# Altium schematic sheet MIPI_DSI_CSI.SchDoc
size 420 x 297 mm; Scale: 1:1; DocumentType: Схема электрическая принципиальная; SheetNumber: 20; SheetTotal: 31; DocumentTypeShort: Э3; DocumentInvertoryNumber: ㅤ
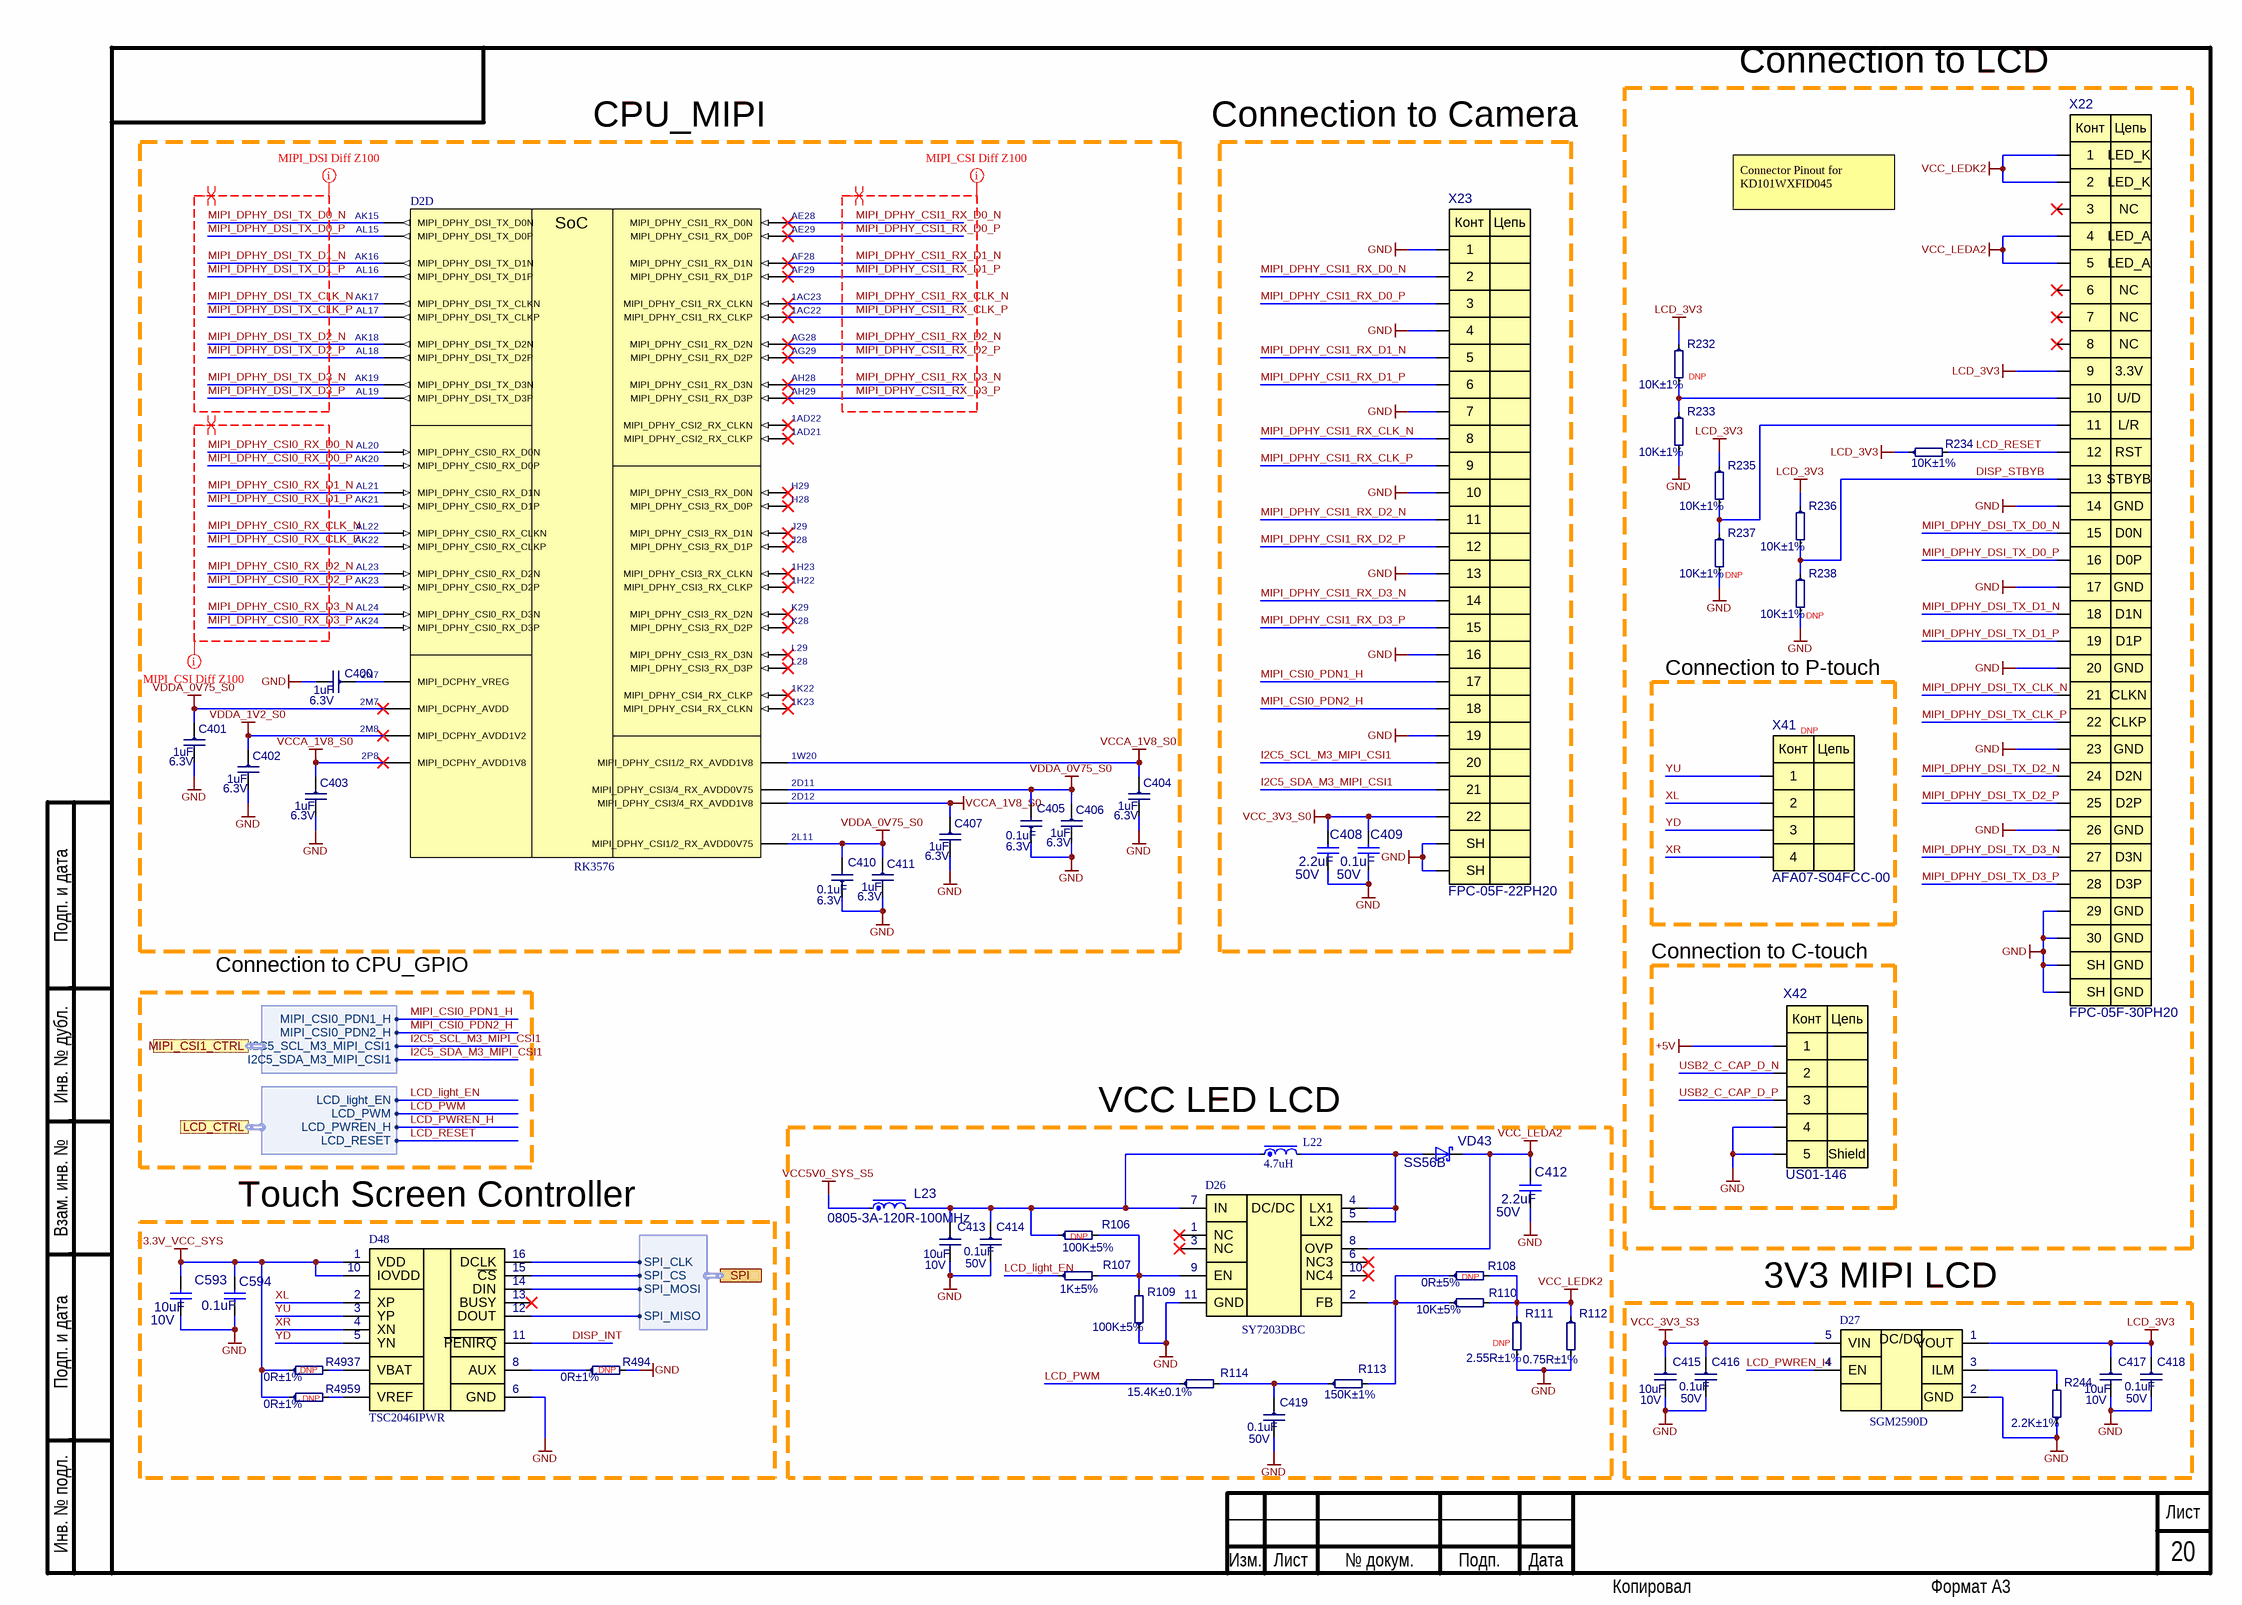
[diagram p0: MIPI_DSI_CSI.SchDoc]

## Parts
C400  1uF  Voltage: 6.3V  [C0201]
C401  1uF  Voltage: 6.3V  [C0201]
C402  1uF  Voltage: 6.3V  [C0201]
C403  1uF  Voltage: 6.3V  [C0201]
C404  1uF  Voltage: 6.3V  [C0201]
C405  0.1uF  Voltage: 6.3V  [C0201]
C406  1uF  Voltage: 6.3V  [C0201]
C407  1uF  Voltage: 6.3V  [C0201]
C408  2.2uF  Voltage: 50V  [C0805]
C409  0.1uF  Voltage: 50V  [C0402]
C410  0.1uF  Voltage: 6.3V  [C0201]
C411  1uF  Voltage: 6.3V  [C0201]
C412  2.2uF  Voltage: 50V  [C0805]
C413  10uF  Voltage: 10V  [C0603]
C414  0.1uF  Voltage: 50V  [C0402]
C415  10uF  Voltage: 10V  [C0603]
C416  0.1uF  Voltage: 50V  [C0402]
C417  10uF  Voltage: 10V  [C0603]
C418  0.1uF  Voltage: 50V  [C0402]
C419  0.1uF  Voltage: 50V  [C0402]
C593  10uF  Voltage: 10V  [C0402]
C594  0.1uF  [C0402]
D2  RK3576  [BGAFCCSP698L]  (part D of 7)
D26  SY7203DBC  [SY7203DBC]
D27  SGM2590D  [SGM2590D]
D48  TSC2046IPWR  [TSC2046IPWR]
L22  4.7uH  [SWPA6045S4R7MT]
L23  0805-3A-120R-100MHz  [L0805]
R106  100K±5%  [R0402]
R107  1K±5%  [R0402]
R108  0R±5%  [R1206]
R109  100K±5%  [R0402]
R110  10K±5%  [R1206]
R111  2.55R±1%  [R1206]
R112  0.75R±1%  [R1206]
R113  150K±1%  [R0402]
R114  15.4K±0.1%  [R0603]
R232  10K±1%  [R0402]
R233  10K±1%  [R0402]
R234  10K±1%  [R0402]
R235  10K±1%  [R0402]
R236  10K±1%  [R0402]
R237  10K±1%  [R0402]
R238  10K±1%  [R0402]
R244  2.2K±1%  [R0402]
R493  0R±1%  [R0402]
R494  0R±1%  [R0402]
R495  0R±1%  [R0402]
VD43  SS56B  [DO-214AA]
X22  FPC-05F-30PH20  [FPC-05F-30PH20]
X23  FPC-05F-22PH20  [FPC-05F-22PH20]
X41  AFA07-S04FCC-00  [AFA07-S04FCC-00]
X42  US01-146  [US01-146]

## Blocks framed on the sheet
Connection to P-touch: X41
Connection to C-touch: X42

## Ports
LCD_CTRL (harness LCD_CTRL), MIPI_CSI1_CTRL (harness MIPI_CSI1), SPI (harness SPI)

## Harnesses
MIPI_CSI1: I2C5_SDA_M3_MIPI_CSI1, I2C5_SCL_M3_MIPI_CSI1, MIPI_CSI0_PDN2_H, MIPI_CSI0_PDN1_H
LCD_CTRL: LCD_RESET, LCD_PWREN_H, LCD_PWM, LCD_light_EN
SPI: SPI_CS, SPI_MISO, SPI_MOSI, SPI_CLK

## Nets
+3.3V_VCC_SYS: C593.2 C594.2 D48.1(VDD) D48.10(IOVDD) R493.1 R495.1
+5V: X42.1
GND: C400.2 C401.2 C402.2 C403.2 C404.2 C405.1 C406.2 C407.2 C408.1 C409.1 C410.1 C411.2 C412.1 C413.2 C414.2 C415.2 C416.2 C417.2 C418.2 C419.2 C593.1 C594.1 D26.11(GND) D27.2(GND) D48.6(GND) R109.1 R111.2 R112.2 R233.2 R237.2 R238.2 R244.1 R494.2 X22.14 X22.17 X22.20 X22.23 X22.26 X22.29 X22.30 X22.S1(SH) X22.S2(SH) X23.1 X23.4 X23.7 X23.10 X23.13 X23.16 X23.19 X23.23(SH) X23.24(SH) X42.4 X42.5
LCD_3V3: C417.1 C418.1 D27.1(VOUT) R232.1 R234.1 R235.1 R236.1 X22.9
VCC5V0_SYS_S5: L23.1
VCC_3V3_S0: C408.2 C409.2 X23.22
VCC_3V3_S3: C415.1 C416.1 D27.5(VIN)
VCC_LEDA2: C412.2 D26.8(OVP) VD43.1(K) X22.4 X22.5
VCC_LEDK2: R108.2 R110.2 R111.1 R112.1 X22.1 X22.2
VCCA_1V8_S0: C403.1 C404.1 C407.1 D2.1W20(MIPI_DPHY_CSI1/2_RX_AVDD1V8) D2.2D12(MIPI_DPHY_CSI3/4_RX_AVDD1V8) D2.2P8(MIPI_DCPHY_AVDD1V8)
VDDA_0V75_S0: C401.1 C405.2 C406.1 C410.2 C411.1 D2.2D11(MIPI_DPHY_CSI3/4_RX_AVDD0V75) D2.2L11(MIPI_DPHY_CSI1/2_RX_AVDD0V75) D2.2M7(MIPI_DCPHY_AVDD)
VDDA_1V2_S0: C402.1 D2.2M8(MIPI_DCPHY_AVDD1V2)
DISP_INT: D48.11(~{PENIRQ})
DISP_STBYB: R236.2 R238.1 X22.13
I2C5_SCL_M3_MIPI_CSI1: X23.20 ; port MIPI_CSI1_CTRL.I2C5_SCL_M3_MIPI_CSI1
I2C5_SDA_M3_MIPI_CSI1: X23.21 ; port MIPI_CSI1_CTRL.I2C5_SDA_M3_MIPI_CSI1
LCD_light_EN: R107.1 ; port LCD_CTRL.LCD_light_EN
LCD_PWM: R114.1 ; port LCD_CTRL.LCD_PWM
LCD_PWREN_H: D27.4(EN) ; port LCD_CTRL.LCD_PWREN_H
LCD_RESET: R234.2 X22.12 ; port LCD_CTRL.LCD_RESET
MIPI_CSI0_PDN1_H: X23.17 ; port MIPI_CSI1_CTRL.MIPI_CSI0_PDN1_H
MIPI_CSI0_PDN2_H: X23.18 ; port MIPI_CSI1_CTRL.MIPI_CSI0_PDN2_H
MIPI_DPHY_CSI0_RX_CLK_N: D2.AL22(MIPI_DPHY_CSI0_RX_CLKN)
MIPI_DPHY_CSI0_RX_CLK_P: D2.AK22(MIPI_DPHY_CSI0_RX_CLKP)
MIPI_DPHY_CSI0_RX_D0_N: D2.AL20(MIPI_DPHY_CSI0_RX_D0N)
MIPI_DPHY_CSI0_RX_D0_P: D2.AK20(MIPI_DPHY_CSI0_RX_D0P)
MIPI_DPHY_CSI0_RX_D1_N: D2.AL21(MIPI_DPHY_CSI0_RX_D1N)
MIPI_DPHY_CSI0_RX_D1_P: D2.AK21(MIPI_DPHY_CSI0_RX_D1P)
MIPI_DPHY_CSI0_RX_D2_N: D2.AL23(MIPI_DPHY_CSI0_RX_D2N)
MIPI_DPHY_CSI0_RX_D2_P: D2.AK23(MIPI_DPHY_CSI0_RX_D2P)
MIPI_DPHY_CSI0_RX_D3_N: D2.AL24(MIPI_DPHY_CSI0_RX_D3N)
MIPI_DPHY_CSI0_RX_D3_P: D2.AK24(MIPI_DPHY_CSI0_RX_D3P)
MIPI_DPHY_CSI1_RX_CLK_N: D2.1AC23(MIPI_DPHY_CSI1_RX_CLKN) X23.8
MIPI_DPHY_CSI1_RX_CLK_P: D2.1AC22(MIPI_DPHY_CSI1_RX_CLKP) X23.9
MIPI_DPHY_CSI1_RX_D0_N: D2.AE28(MIPI_DPHY_CSI1_RX_D0N) X23.2
MIPI_DPHY_CSI1_RX_D0_P: D2.AE29(MIPI_DPHY_CSI1_RX_D0P) X23.3
MIPI_DPHY_CSI1_RX_D1_N: D2.AF28(MIPI_DPHY_CSI1_RX_D1N) X23.5
MIPI_DPHY_CSI1_RX_D1_P: D2.AF29(MIPI_DPHY_CSI1_RX_D1P) X23.6
MIPI_DPHY_CSI1_RX_D2_N: D2.AG28(MIPI_DPHY_CSI1_RX_D2N) X23.11
MIPI_DPHY_CSI1_RX_D2_P: D2.AG29(MIPI_DPHY_CSI1_RX_D2P) X23.12
MIPI_DPHY_CSI1_RX_D3_N: D2.AH28(MIPI_DPHY_CSI1_RX_D3N) X23.14
MIPI_DPHY_CSI1_RX_D3_P: D2.AH29(MIPI_DPHY_CSI1_RX_D3P) X23.15
MIPI_DPHY_DSI_TX_CLK_N: D2.AK17(MIPI_DPHY_DSI_TX_CLKN) X22.21
MIPI_DPHY_DSI_TX_CLK_P: D2.AL17(MIPI_DPHY_DSI_TX_CLKP) X22.22
MIPI_DPHY_DSI_TX_D0_N: D2.AK15(MIPI_DPHY_DSI_TX_D0N) X22.15
MIPI_DPHY_DSI_TX_D0_P: D2.AL15(MIPI_DPHY_DSI_TX_D0P) X22.16
MIPI_DPHY_DSI_TX_D1_N: D2.AK16(MIPI_DPHY_DSI_TX_D1N) X22.18
MIPI_DPHY_DSI_TX_D1_P: D2.AL16(MIPI_DPHY_DSI_TX_D1P) X22.19
MIPI_DPHY_DSI_TX_D2_N: D2.AK18(MIPI_DPHY_DSI_TX_D2N) X22.24
MIPI_DPHY_DSI_TX_D2_P: D2.AL18(MIPI_DPHY_DSI_TX_D2P) X22.25
MIPI_DPHY_DSI_TX_D3_N: D2.AK19(MIPI_DPHY_DSI_TX_D3N) X22.27
MIPI_DPHY_DSI_TX_D3_P: D2.AL19(MIPI_DPHY_DSI_TX_D3P) X22.28
USB2_C_CAP_D_N: X42.2
USB2_C_CAP_D_P: X42.3
XL: D48.2(XP) X41.2
XR: D48.4(XN) X41.4
YD: D48.5(YN) X41.3
YU: D48.3(YP) X41.1
NetC400_1: C400.1 D2.2N7(MIPI_DCPHY_VREG)
NetC413_1: C413.1 C414.1 D26.7(IN) L22.1 L23.2 R106.1
NetC419_1: C419.1 R113.1 R114.2
NetD26_2: D26.2(FB) R108.1 R110.1 R113.2
NetD26_4: D26.4(LX1) D26.5(LX2) L22.2 VD43.2(A)
NetD26_9: D26.9(EN) R106.2 R107.2 R109.2
NetD27_3: D27.3(ILM) R244.2
NetD48_7: D48.7(VBAT) R493.2
NetD48_8: D48.8(AUX) R494.1
NetD48_9: D48.9(VREF) R495.2
NetD48_12: D48.12(DOUT) ; port SPI.SPI_MISO
NetD48_14: D48.14(DIN) ; port SPI.SPI_MOSI
NetD48_15: D48.15(~{CS}) ; port SPI.SPI_CS
NetD48_16: D48.16(DCLK) ; port SPI.SPI_CLK
NetR232_2: R232.2 R233.1 X22.10
NetR235_2: R235.2 R237.1 X22.11

Not connected (* = marked no-connect by the designer): D2 1AD21(MIPI_DPHY_CSI2_RX_CLKP)* 1AD22(MIPI_DPHY_CSI2_RX_CLKN)* 1H22(MIPI_DPHY_CSI3_RX_CLKP)* 1H23(MIPI_DPHY_CSI3_RX_CLKN)* 1K22(MIPI_DPHY_CSI4_RX_CLKP)* 1K23(MIPI_DPHY_CSI4_RX_CLKN)* H28(MIPI_DPHY_CSI3_RX_D0P)* H29(MIPI_DPHY_CSI3_RX_D0N)* J28(MIPI_DPHY_CSI3_RX_D1P)* J29(MIPI_DPHY_CSI3_RX_D1N)* K28(MIPI_DPHY_CSI3_RX_D2P)* K29(MIPI_DPHY_CSI3_RX_D2N)* L28(MIPI_DPHY_CSI3_RX_D3P)* L29(MIPI_DPHY_CSI3_RX_D3N)*; D26 1(NC)* 3(NC)* 6(NC3)* 10(NC4)*; D48 13(BUSY)*; X22 3* 6* 7* 8*

## Layout directives
differential pair: MIPI_DPHY_CSI0_RX_CLK_N, MIPI_DPHY_CSI0_RX_CLK_P, MIPI_DPHY_CSI0_RX_D0_N, MIPI_DPHY_CSI0_RX_D0_P, MIPI_DPHY_CSI0_RX_D1_N, MIPI_DPHY_CSI0_RX_D1_P, MIPI_DPHY_CSI0_RX_D2_N, MIPI_DPHY_CSI0_RX_D2_P, MIPI_DPHY_CSI0_RX_D3_N, MIPI_DPHY_CSI0_RX_D3_P, MIPI_DPHY_CSI1_RX_CLK_N, MIPI_DPHY_CSI1_RX_CLK_P, MIPI_DPHY_CSI1_RX_D0_N, MIPI_DPHY_CSI1_RX_D0_P, MIPI_DPHY_CSI1_RX_D1_N, MIPI_DPHY_CSI1_RX_D1_P, MIPI_DPHY_CSI1_RX_D2_N, MIPI_DPHY_CSI1_RX_D2_P, MIPI_DPHY_CSI1_RX_D3_N, MIPI_DPHY_CSI1_RX_D3_P, MIPI_DPHY_DSI_TX_CLK_N, MIPI_DPHY_DSI_TX_CLK_P, MIPI_DPHY_DSI_TX_D0_N, MIPI_DPHY_DSI_TX_D0_P, MIPI_DPHY_DSI_TX_D1_N, MIPI_DPHY_DSI_TX_D1_P, MIPI_DPHY_DSI_TX_D2_N, MIPI_DPHY_DSI_TX_D2_P, MIPI_DPHY_DSI_TX_D3_N, MIPI_DPHY_DSI_TX_D3_P
net class MIPI_CSI1: MIPI_DPHY_CSI1_RX_CLK_N, MIPI_DPHY_CSI1_RX_CLK_P, MIPI_DPHY_CSI1_RX_D0_N, MIPI_DPHY_CSI1_RX_D0_P, MIPI_DPHY_CSI1_RX_D1_N, MIPI_DPHY_CSI1_RX_D1_P, MIPI_DPHY_CSI1_RX_D2_N, MIPI_DPHY_CSI1_RX_D2_P, MIPI_DPHY_CSI1_RX_D3_N, MIPI_DPHY_CSI1_RX_D3_P
net class MIPI_DSI: MIPI_DPHY_DSI_TX_CLK_N, MIPI_DPHY_DSI_TX_CLK_P, MIPI_DPHY_DSI_TX_D0_N, MIPI_DPHY_DSI_TX_D0_P, MIPI_DPHY_DSI_TX_D1_N, MIPI_DPHY_DSI_TX_D1_P, MIPI_DPHY_DSI_TX_D2_N, MIPI_DPHY_DSI_TX_D2_P, MIPI_DPHY_DSI_TX_D3_N, MIPI_DPHY_DSI_TX_D3_P
net class MIPI_CSI0: MIPI_DPHY_CSI0_RX_CLK_N, MIPI_DPHY_CSI0_RX_CLK_P, MIPI_DPHY_CSI0_RX_D0_N, MIPI_DPHY_CSI0_RX_D0_P, MIPI_DPHY_CSI0_RX_D1_N, MIPI_DPHY_CSI0_RX_D1_P, MIPI_DPHY_CSI0_RX_D2_N, MIPI_DPHY_CSI0_RX_D2_P, MIPI_DPHY_CSI0_RX_D3_N, MIPI_DPHY_CSI0_RX_D3_P

## Notes on the sheet
- Connection to LCD
- CPU_MIPI
- Connection to Camera
- Connector Pinout for KD101WXFID045
- (near X22) LED_K
- (near X22) NC
- (near X22) LED_A
- (near R232) DNP
- (near X22) 3.3V
- (near X22) U/D
- (near X22) L/R
- (near X22) RST
- (near X22) STBYB
- (near X22) GND
- (near X22) D0N
- (near R237) DNP
- (near X22) D0P
- (near X22) D1N
- (near R238) DNP
- (near X22) D1P
- (near X41) DNP
- (near X22) CLKN
- (near X22) CLKP
- (near X22) D2N
- (near X22) D2P
- (near X22) D3N
- (near X22) D3P
- Connection to CPU_GPIO
- (near L22) VCC LED LCD
- Touch Screen Controller
- (near R106) DNP
- (near R108) DNP
- (near D27) 3V3 MIPI LCD
- (near R111) DNP
- (near R493) DNP
- (near R495) DNP
- (near R494) DNP
- Подп. и дата
- Инв. № дубл.
- Взам. инв. №
- Инв. № подл.
- Изм.
- Лист
- № докум.
- Подп.
- Дата
- Копировал
- Формат А3
- (in symbol AFA07-S04FCC-00) Конт; Цепь
- (in symbol FPC-05F-22PH20) Конт; Цепь
- (in symbol FPC-05F-30PH20) Конт; Цепь
- (in symbol RK3576, part D) SoC
- (in symbol SGM2590D) DC/DC
- (in symbol SY7203DBC) DC/DC
- (in symbol US01-146) Конт; Цепь; Shield

## Library data of the parts
C400-C404 C406 C407 C411 = 0201-X5R-6.3V-1uF±20%: Manufacturer: Murata Electronics; NameFromManufacturer: GRM033R60J105MEA2D; Dielectric: X5R; Place: *); Tolerance: 20%; Check: False; Case: C0201; Part Number: 0201-X5R-6.3V-1uF±20%; Value: 1uF; Temperature: -55°C~85°C; ComponentLink2Description: Link to datasheet; ComponentLink1Description: DATASHEET; ComponentLink2URL: https://www.terraelectronica.ru/product/1209278; ComponentLink1URL: Datasheets/capacitors/GRM033R60J105MEA2-61A.pdf; Last changed: 27.10.2022
C405 C410 = 0201-X5R-6.3V-0.1uF±10%: Manufacturer: Yageo; NameFromManufacturer: CC0201KRX5R5BB104; Dielectric: X5R; Place: *); Tolerance: 10%; Check: False; Case: C0201; Part Number: 0201-X5R-6.3V-0.1uF±10%; Value: 0.1uF; Temperature: -55°C~85°C; ComponentLink2Description: Link to datasheet; ComponentLink1Description: DATASHEET; ComponentLink2URL: https://www.terraelectronica.ru/product/1020032; ComponentLink1URL: Datasheets/capacitors/UPY-GPHC_X5R_4V-to-50V_27.pdf; Last changed: 27.10.2022
C408 C412 = 0805-X7R-50V-2.2uF±10%: Manufacturer: Yageo; NameFromManufacturer: CC0805KKX7R9BB225; Place: S; Tolerance: 10%; Check: False; Part Number: 0805-X7R-50V-2.2uF±10%; Value: 2.2uF; Temperature: -55°C~125°C; ComponentLink2Description: Link to datasheet; ComponentLink1Description: DATASHEET; ComponentLink2URL: https://www.yageo.com/upload/media/product/productsearch/datasheet/mlcc/UPY-GPHC_X7R_6.3V-to-50V_18.pdf; ComponentLink1URL: Datasheets/capacitors/UPY-GPHC_X7R_6.3V-to-50V_18.pdf; Last changed: 27.10.2022
C409 = 0402-X5R-50V-0.1uF±10%: Manufacturer: Yageo; NameFromManufacturer: CC0402KRX5R9BB104; Place: S; Tolerance: 10%; Check: False; Part Number: 0402-X5R-50V-0.1uF±10%; Value: 0.1uF; Temperature: -55°C~85°C; ComponentLink2Description: Link to datasheet; ComponentLink1Description: DATASHEET; ComponentLink2URL: https://www.yageo.com/upload/media/product/productsearch/datasheet/mlcc/UPY-GPHC_X5R_4V-to-50V_26.pdf; ComponentLink1URL: Datasheets/capacitors/UPY-GPHC_X5R_4V-to-50V_26.pdf; Last changed: 27.10.2022
C413 C415 C417 = 0603-X5R-10V-10uF±10%: *; Manufacturer: Yageo; NameFromManufacturer: CC0603KRX5R6BB106; Dielectric: X5R; Place: *); Tolerance: 10%; Check: False; Case: C0603; Part Number: 0603-X5R-10V-10uF±10%; Value: 10uF; Temperature: -55°C~85°C; ComponentLink2Description: Link to datasheet; ComponentLink1Description: DATASHEET; ComponentLink2URL: https://www.yageo.com/upload/media/product/productsearch/datasheet/mlcc/UPY-GPHC_X5R_4V-to-50V_26.pdf; ComponentLink1URL: Datasheets/capacitors/UPY-GPHC_X5R_4V-to-50V_26.pdf; Last changed: 27.10.2022
C414 C416 C418 C419 = 0402-X5R-50V-0.1uF±10%: Manufacturer: Yageo; NameFromManufacturer: CC0402KRX5R9BB104; Dielectric: X5R; Place: *); Tolerance: 10%; Check: False; Case: C0402; Part Number: 0402-X5R-50V-0.1uF±10%; Value: 0.1uF; Temperature: -55°C~85°C; ComponentLink2Description: Link to datasheet; ComponentLink1Description: DATASHEET; ComponentLink2URL: https://www.yageo.com/upload/media/product/productsearch/datasheet/mlcc/UPY-GPHC_X5R_4V-to-50V_26.pdf; ComponentLink1URL: Datasheets/capacitors/UPY-GPHC_X5R_4V-to-50V_26.pdf; Last changed: 27.10.2022
C593 = 0402-X5R-10V-10uF±20: *; Manufacturer: Samsung; NameFromManufacturer: CL05A106MP5NUNC; Place: S; Tolerance: 20%; Check: False; Part Number: 0402-X5R-10V-10uF±20; Value: 10uF; Temperature: -55°C~85°C; ComponentLink2Description: Link to datasheet; ComponentLink1Description: DATASHEET; Last changed: 06.04.2023
C594 = 0402-X5R-50V-0.1uF±10%: Manufacturer: Yageo; NameFromManufacturer: CC0402KRX5R9BB104; Place: S; Voltage: 50V; Tolerance: 10%; Check: False; Part Number: 0402-X5R-50V-0.1uF±10%; Value: 0.1uF; Temperature: -55°C~85°C; ComponentLink2Description: Link to datasheet; ComponentLink1Description: DATASHEET; ComponentLink2URL: https://www.yageo.com/upload/media/product/productsearch/datasheet/mlcc/UPY-GPHC_X5R_4V-to-50V_26.pdf; ComponentLink1URL: Datasheets/capacitors/UPY-GPHC_X5R_4V-to-50V_26.pdf; Last changed: 27.10.2022
D2 = RK3576: SoC 4xCortex-A72@2.2Ghz+4xCortex-A53@2Ghz, LPDDR4/4X/5/5X, SDIO/eMMC/UFS/FSPI, BGA 16.1x17.2x1.0mm; Manufacturer: Rockship; Place: *); Check: False; Part Number: RK3576; Temperature: -40°C~85°C; Value: RK3576; ComponentLink1Description: DATASHEET; NameFromManufacturer: RK3576; ComponentLink1URL: https://wiki.friendlyelec.com/wiki/images/b/bf/Rockchip_RK3576_Datasheet_V1.5-20241216.pdf; Last changed: 06.01.2026
D26 = SY7203DBC: 1MHz PWM Boost 1 DC-DC 2.8V~30V DFN-10-EP(3x3) LED Drivers ICs RoHS; Manufacturer: Silergy; Check: False; Part Number: SY7203DBC; NameFromManufacturer: SY7203DBC; Value: SY7203DBC
D27 = SGM2590D: Manufacturer: SGM; Check: False; Part Number: SGM2590D; NameFromManufacturer: SGM2590D; Value: SGM2590D
D48 = TSC2046IPWR: SPI 12 2.2V~5.25V TSSOP-16 Touch Screen Controllers; Manufacturer: Texas; Check: False; Part Number: TSC2046IPWR; NameFromManufacturer: TSC2046IPWR; Value: TSC2046IPWR
L22 = SWPA6045S4R7MT: SMD Power Inductor; Manufacturer: Sunlord; Current: 3.3A; Check: False; Part Number: SWPA6045S4R7MT; Value: 4.7uH; NameFromManufacturer: SWPA6045S4R7MT
L23 = 0805-3A-120R-100MHz: *; Part Number: CBM201209U121T; Manufacturer: FH; Place: S; Tolerance: 25%; Current: 3A; DC Resistance: 0.03R; Check: False; Analog: CBM201209U121T, BLM21PG121SH1D; Value: 0805-3A-120R-100MHz; Temperature: -55°C~125°C; ComponentLink1Description: DATASHEET; NameFromManufacturer: CBM201209U121T; ComponentLink1URL: https://www.terraelectronica.ru/product/854541; Datasheet: Datasheets/inductors/QNFA9102.pdf; Last changed: 27.10.2022
R106 R109 = 0402-0.0625W-100K-100ppm±5%: NameFromManufacturer: RC0402JR-07100KL; Manufacturer: Yageo; Place: *); Value: 100K; Tolerance: 5%; Check: False; Case: R0402; Part Number: 0402-0.0625W-100K-100ppm±5%; Temperature: -55°C~155°C; ComponentLink1Description: DATASHEET; ComponentLink1URL: https://ru.mouser.com/ProductDetail/YAGEO/RC0402JR-07100KL?qs=%2Fha2pyFadugNN0LzwXn2qCsICuw6vgLBeLL%252BmXUKy2OLGS9kgqrNBA%3D%3D; Datasheet: Datasheets/resistors/PYu-RC_Group_51_RoHS_L_11.pdf; Last changed: 27.10.2022
R107 = 0402-0.0625W-1K-100ppm±5%: NameFromManufacturer: RC0402JR-071KL; Manufacturer: Yageo; Place: *); Value: 1K; Tolerance: 5%; Check: False; Case: R0402; Part Number: 0402-0.0625W-1K-100ppm±5%; Temperature: -55°C~155°C; ComponentLink1Description: DATASHEET; ComponentLink1URL: https://ru.mouser.com/ProductDetail/YAGEO/RC0402JR-071KL?qs=%2Fha2pyFadugNN0LzwXn2qBG%2Fxv0pCy6gh7Z%252B1hZJT2CnjLeHVORGDQ%3D%3D; Datasheet: Datasheets/resistors/PYu-RC_Group_51_RoHS_L_11.pdf; Last changed: 27.10.2022
R108 = 1206-0.25W-0R-200ppm±5%: NameFromManufacturer: RC1206JR-070RL; Manufacturer: Yageo; Place: *); Value: 0R; Tolerance: 5%; Check: False; Case: R1206; Part Number: 1206-0.25W-0R-200ppm±5%; Temperature: -55°C~155°C; ComponentLink1Description: DATASHEET; ComponentLink1URL: https://www.yageo.com/upload/media/product/productsearch/datasheet/rchip/PYu-RC_Group_51_RoHS_L_11.pdf; Datasheet: Datasheets/resistors/PYu-RC_Group_51_RoHS_L_11.pdf; Last changed: 27.10.2022
R110 = 1206-0.25W-10K-100ppm±5%: NameFromManufacturer: RC1206JR-1310KL; Manufacturer: Yageo; Place: *); Value: 10K; Tolerance: 5%; Check: False; Case: R1206; Part Number: 1206-0.25W-10K-100ppm±5%; Temperature: -55°C~155°C; ComponentLink1Description: DATASHEET; ComponentLink1URL: https://www.digikey.com/en/products/detail/yageo/RC1206JR-1310KL/14286743; Datasheet: Datasheets/resistors/PYu-RC_Group_51_RoHS_L_11.pdf; Last changed: 27.10.2022
R111 = 1206-0.25W-2.55R-100ppm±1%: NameFromManufacturer: RC1206FR-072R55L; Manufacturer: Yageo; Place: *); Value: 2.55R; Tolerance: 1%; Check: False; Case: R1206; Part Number: 1206-0.25W-2.55R-100ppm±1%; Temperature: -55°C~155°C; ComponentLink1Description: DATASHEET; ComponentLink1URL: https://www.compel.ru/infosheet/YAG/RC1206FR-072R55L?ysclid=l8w3ov904s325141315; Datasheet: Datasheets/resistors/PYu-RC_Group_51_RoHS_L_12.pdf; Last changed: 27.10.2022
R112 = 1206-0.25W-2.55R-100ppm±1%: Part Number: 1206-0.25W-0.75R-100ppm±1%; NameFromManufacturer: 1206W4F750LT5E; Manufacturer: UNI-ROYAL; Place: *); Value: 0.75R; Tolerance: 1%; Check: False; Case: R1206; Temperature: -55°C~155°C; ComponentLink1Description: DATASHEET; ComponentLink1URL: https://www.compel.ru/infosheet/YAG/RC1206FR-072R55L?ysclid=l8w3ov904s325141315; Datasheet: Datasheets/resistors/PYu-RC_Group_51_RoHS_L_12.pdf; Last changed: 27.10.2022
R113 = 0402-0.0625W-150K-100ppm±1%: NameFromManufacturer: RC0402FR-07150KL; Manufacturer: Yageo; Place: *); Value: 150K; Tolerance: 1%; Check: False; Case: R0402; Part Number: 0402-0.0625W-150K-100ppm±1%; Temperature: -55°C~155°C; ComponentLink1Description: DATASHEET; ComponentLink1URL: https://www.yageo.com/upload/media/product/productsearch/datasheet/rchip/PYu-RC_Group_51_RoHS_L_11.pdf; Datasheet: Datasheets/resistors/PYu-RC_Group_51_RoHS_L_11.pdf; Last changed: 27.10.2022
R114 = 0603-0.1W-15.4K-25ppm±0.1%: *; NameFromManufacturer: RT0603BRD0715K4L; Manufacturer: Yageo; Place: *); Value: 15.4K; Tolerance: 0.1%; Check: False; Case: R0603; Part Number: 0603-0.1W-15.4K-25ppm±0.1%; Temperature: -55°C~155°C; ComponentLink1Description: DATASHEET; ComponentLink1URL: https://eu.mouser.com/ProductDetail/YAGEO/RT0603BRD0715K4L?qs=gY0y7AQI9SPftUs%252Borrx5g%3D%3D; Datasheet: Datasheets\resistors\RT0603BRD0715K4L-datasheet-pdf-ru.findic.com.pdf#Datasheets\resistors\RT0603BRD0715K4L-datasheet-pdf-ru.findic.com.pdf#; Last changed: 08.11.2022
R232-R238 = 0402-0.0625W-10K-100ppm±1%: Chip Resistor 0402 10kΩ ±1% 50V ±100ppm/℃ Thick Film; NameFromManufacturer: RC0402FR-0710KL; Manufacturer: Yageo; Place: *); Value: 10K; Check: False; Case: R0402; Part Number: 0402-0.0625W-10K-100ppm±1%; Tolerance: 1%; Temperature: -55°C~155°C; ComponentLink1Description: DATASHEET; ComponentLink1URL: https://ru.mouser.com/ProductDetail/YAGEO/RC0402FR-0710KL?qs=%2Fha2pyFaduhjtLcYvKXQ8IogF7YwN7YtH%252BOO8ZtEEMnoa4yoWYcwpw%3D%3D; Datasheet: Datasheets/resistors/PYu-RC_Group_51_RoHS_L_11.pdf; Last changed: 27.10.2022
R244 = 0402-0.0625W-2.2K-100ppm±1%: *; NameFromManufacturer: RC0402FR-072K2L; Manufacturer: Yageo; Place: *); Value: 2.2K; Tolerance: 1%; Check: False; Case: R0402; Part Number: 0402-0.0625W-2.2K-100ppm±1%; Temperature: -55°C~155°C; ComponentLink1Description: DATASHEET; ComponentLink1URL: https://www.compel.ru/infosheet/YAG/SR0402FR-072K2L; Datasheet: Datasheets/resistors/PYu-SR_D_F tol_RoHS_L_5.pdf; Last changed: 27.10.2022
R493-R495 = 0402-0.0625W-0R-100ppm±1%: Chip Resistor 0402 0Ω ±1% 50V ±100ppm/℃ Thick Film; NameFromManufacturer: RC0402FR-070RL; Manufacturer: Yageo; Place: *); Value: 0R; Check: False; Case: R0402; Part Number: 0402-0.0625W-0R-100ppm±1%; Tolerance: 1%; Temperature: -55°C~155°C; ComponentLink1Description: DATASHEET; ComponentLink1URL: https://www.chipdip.ru/product0/8000617426?ysclid=l7og5x0plo427794326; Datasheet: Datasheets/resistors/DOC012445956.pdf; Last changed: 27.10.2022
VD43 = B360BQ-13-F: Schottky Rectifier; Manufacturer: Yangjie (YJ); Place: S; Check: False; Part Number: SS56B; Value: SS56B; Temperature: -55°C~150°C; NameFromManufacturer: SS56B; Last changed: 27.10.2022
X22 = FPC-05F-30PH20: Flip type -25℃~+85℃ 30P Bottom Contact Horizontal attachment 0.5mm SMD,P=0.5mm,Surface Mount，Right Angle FFC, FPC (Flat Flexible) Connector; Manufacturer: XUNPU; Check: False; Part Number: FPC-05F-30PH20; Value: FPC-05F-30PH20; NameFromManufacturer: FPC-05F-30PH20
X23 = FPC-05F-22PH20: FFC/FPC Connector 22 Position 0.5mm Pitch Bottom Contact Surface Mount, Right Angle -25℃~+85℃; Manufacturer: XUNPU; Check: False; Part Number: FPC-05F-22PH20; Value: FPC-05F-22PH20; NameFromManufacturer: FPC-05F-22PH20
X41 = AFA07-S04FCC-00: rawer Type 4P Bottom Contact Horizontal attachment 1mm SMD,P=1mm,Surface Mount，Right Angle FFC, FPC (Flat Flexible) Connector Assemblies ROHS; Manufacturer: JUSHUO; Check: False; Part Number: AFA07-S04FCC-00; Value: AFA07-S04FCC-00; NameFromManufacturer: AFA07-S04FCC-00
X42 = US01-146: USB Female SMT 90° A type; Manufacturer: Dart; Place: *); Check: False; Part Number: US01-146; Value: US01-146; ComponentLink1Description: DATASHEET; NameFromManufacturer: US01-146; ComponentLink1URL: http://www.dart.moscow/index.php?productcode=139021; Datasheet: Datasheets/connectors/getfile (11).jpeg; Last changed: 27.10.2022